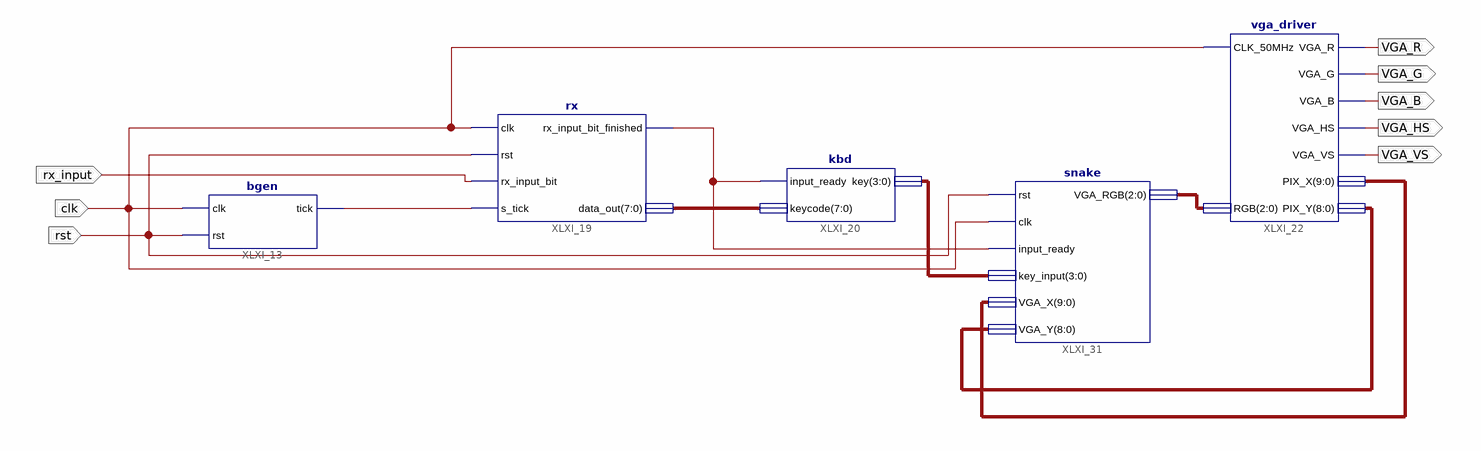
[diagram p0: schematic sheet 1]
// Xilinx ISE schematic schem.sch (spartan3e) as structural Verilog: 5 symbols, 8 ports
module schem (
  input  rst,
  input  rx_input,
  input  clk,
  output VGA_R,
  output VGA_G,
  output VGA_B,
  output VGA_HS,
  output VGA_VS
);

  wire XLXN_76, XLXN_81;
  wire [2:0] XLXN_83;
  wire [3:0] XLXN_82;
  wire [7:0] XLXN_80;
  wire [8:0] XLXN_102;
  wire [9:0] XLXN_103;

  bgen XLXI_13 (.clk(clk), .rst(rst), .tick(XLXN_76));
  rx XLXI_19 (
    .clk(clk), .rst(rst), .rx_input_bit(rx_input), .s_tick(XLXN_76), .rx_input_bit_finished(XLXN_81),
    .data_out(XLXN_80));
  kbd XLXI_20 (.input_ready(XLXN_81), .keycode(XLXN_80), .key(XLXN_82));
  vga_driver XLXI_22 (
    .CLK_50MHz(clk), .RGB(XLXN_83), .VGA_R(VGA_R), .VGA_G(VGA_G), .VGA_B(VGA_B), .VGA_HS(VGA_HS),
    .VGA_VS(VGA_VS), .PIX_X(XLXN_103), .PIX_Y(XLXN_102));
  snake XLXI_31 (
    .rst(rst), .clk(clk), .input_ready(XLXN_81), .key_input(XLXN_82), .VGA_X(XLXN_103), .VGA_Y(XLXN_102),
    .VGA_RGB(XLXN_83));
endmodule
